# EAGLE design OVERWATCH Node (EAGLE 9.5.0)
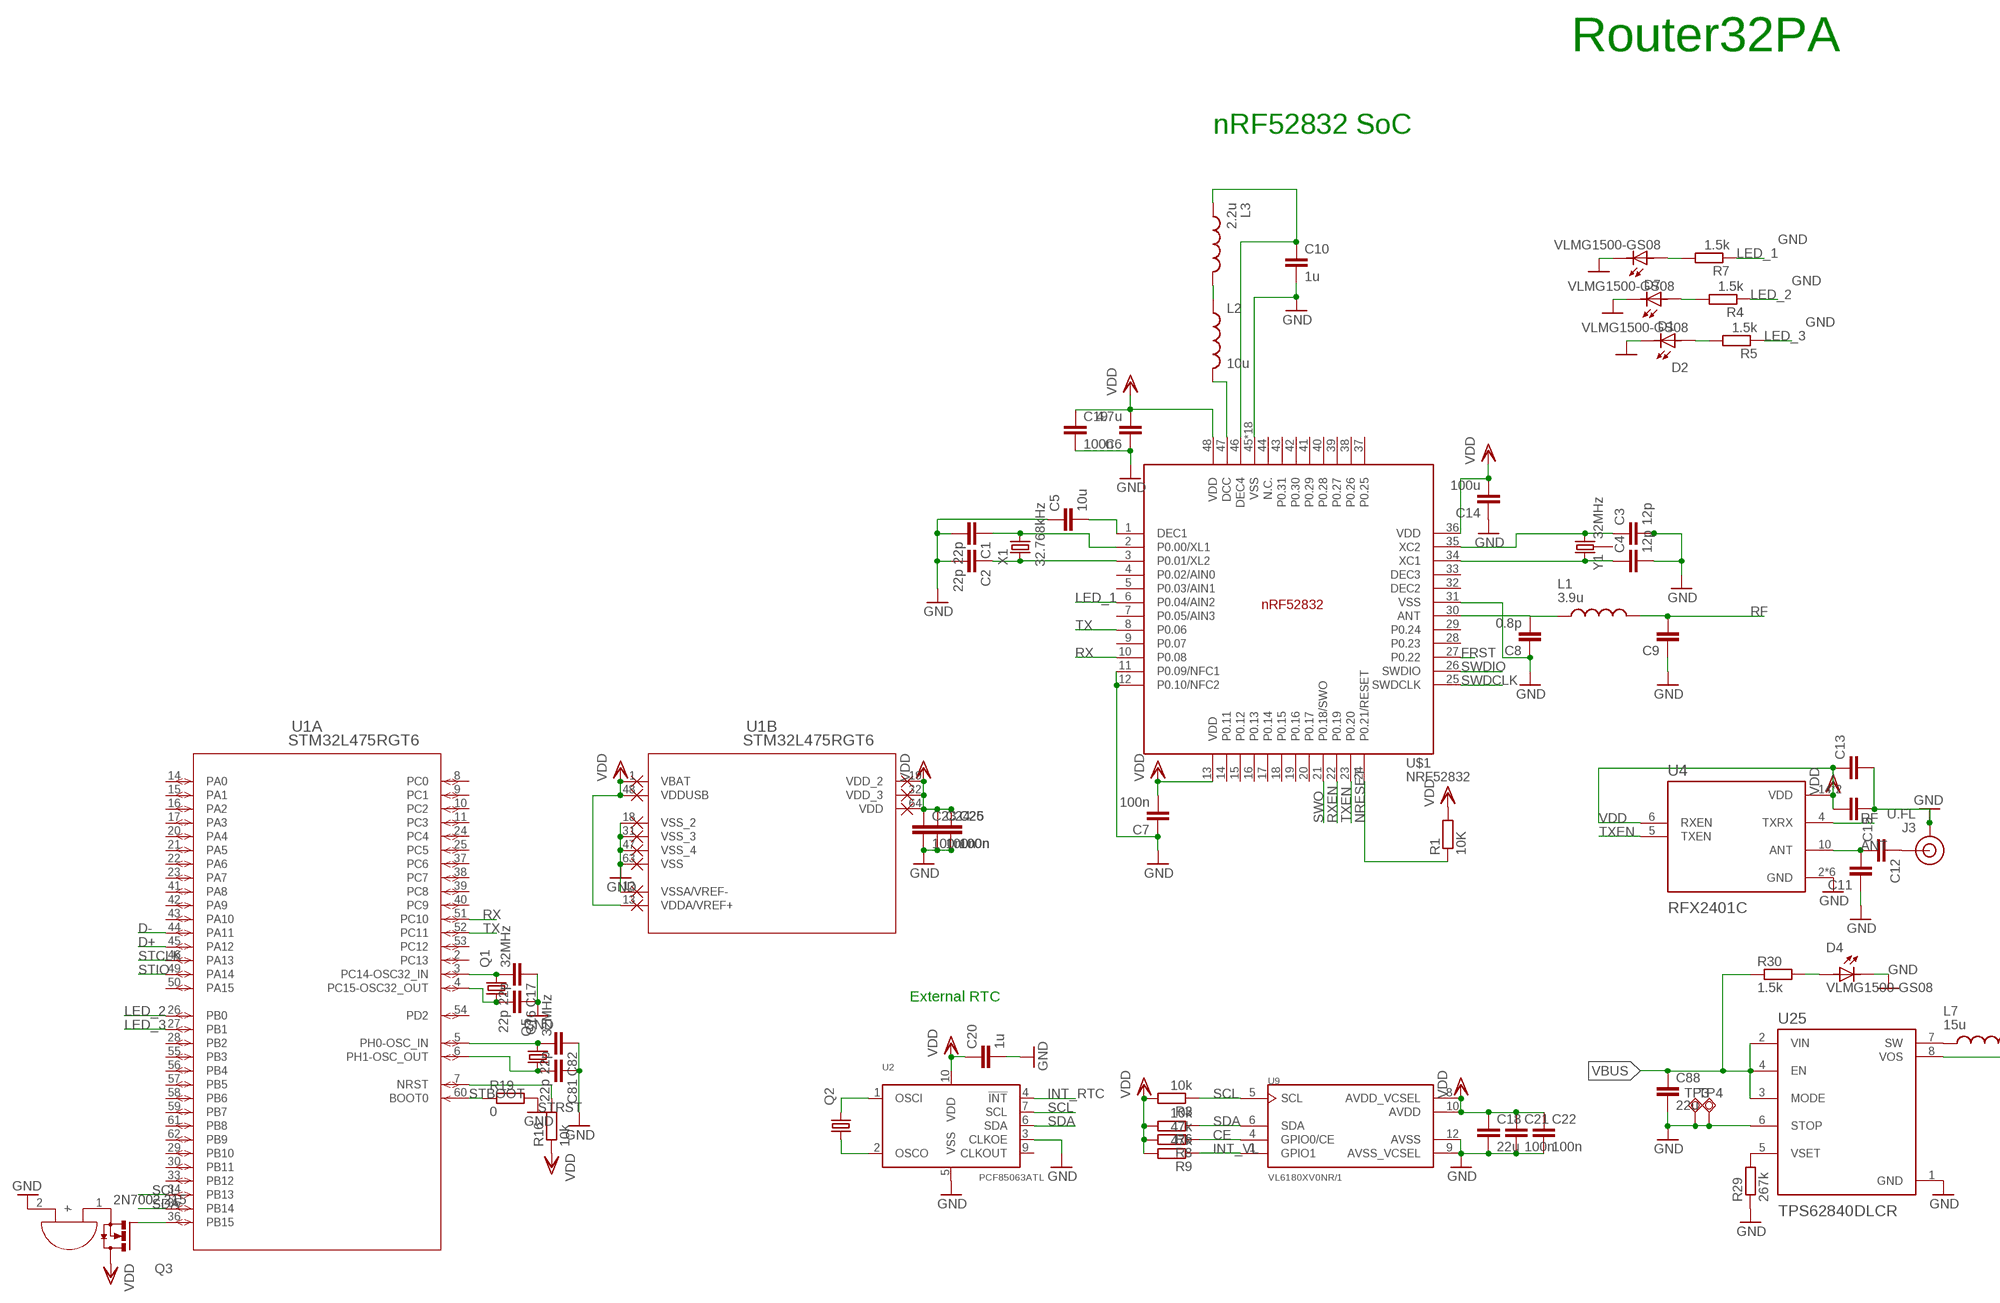
[diagram p0: schematic, sheet 1, part 1 of 2]
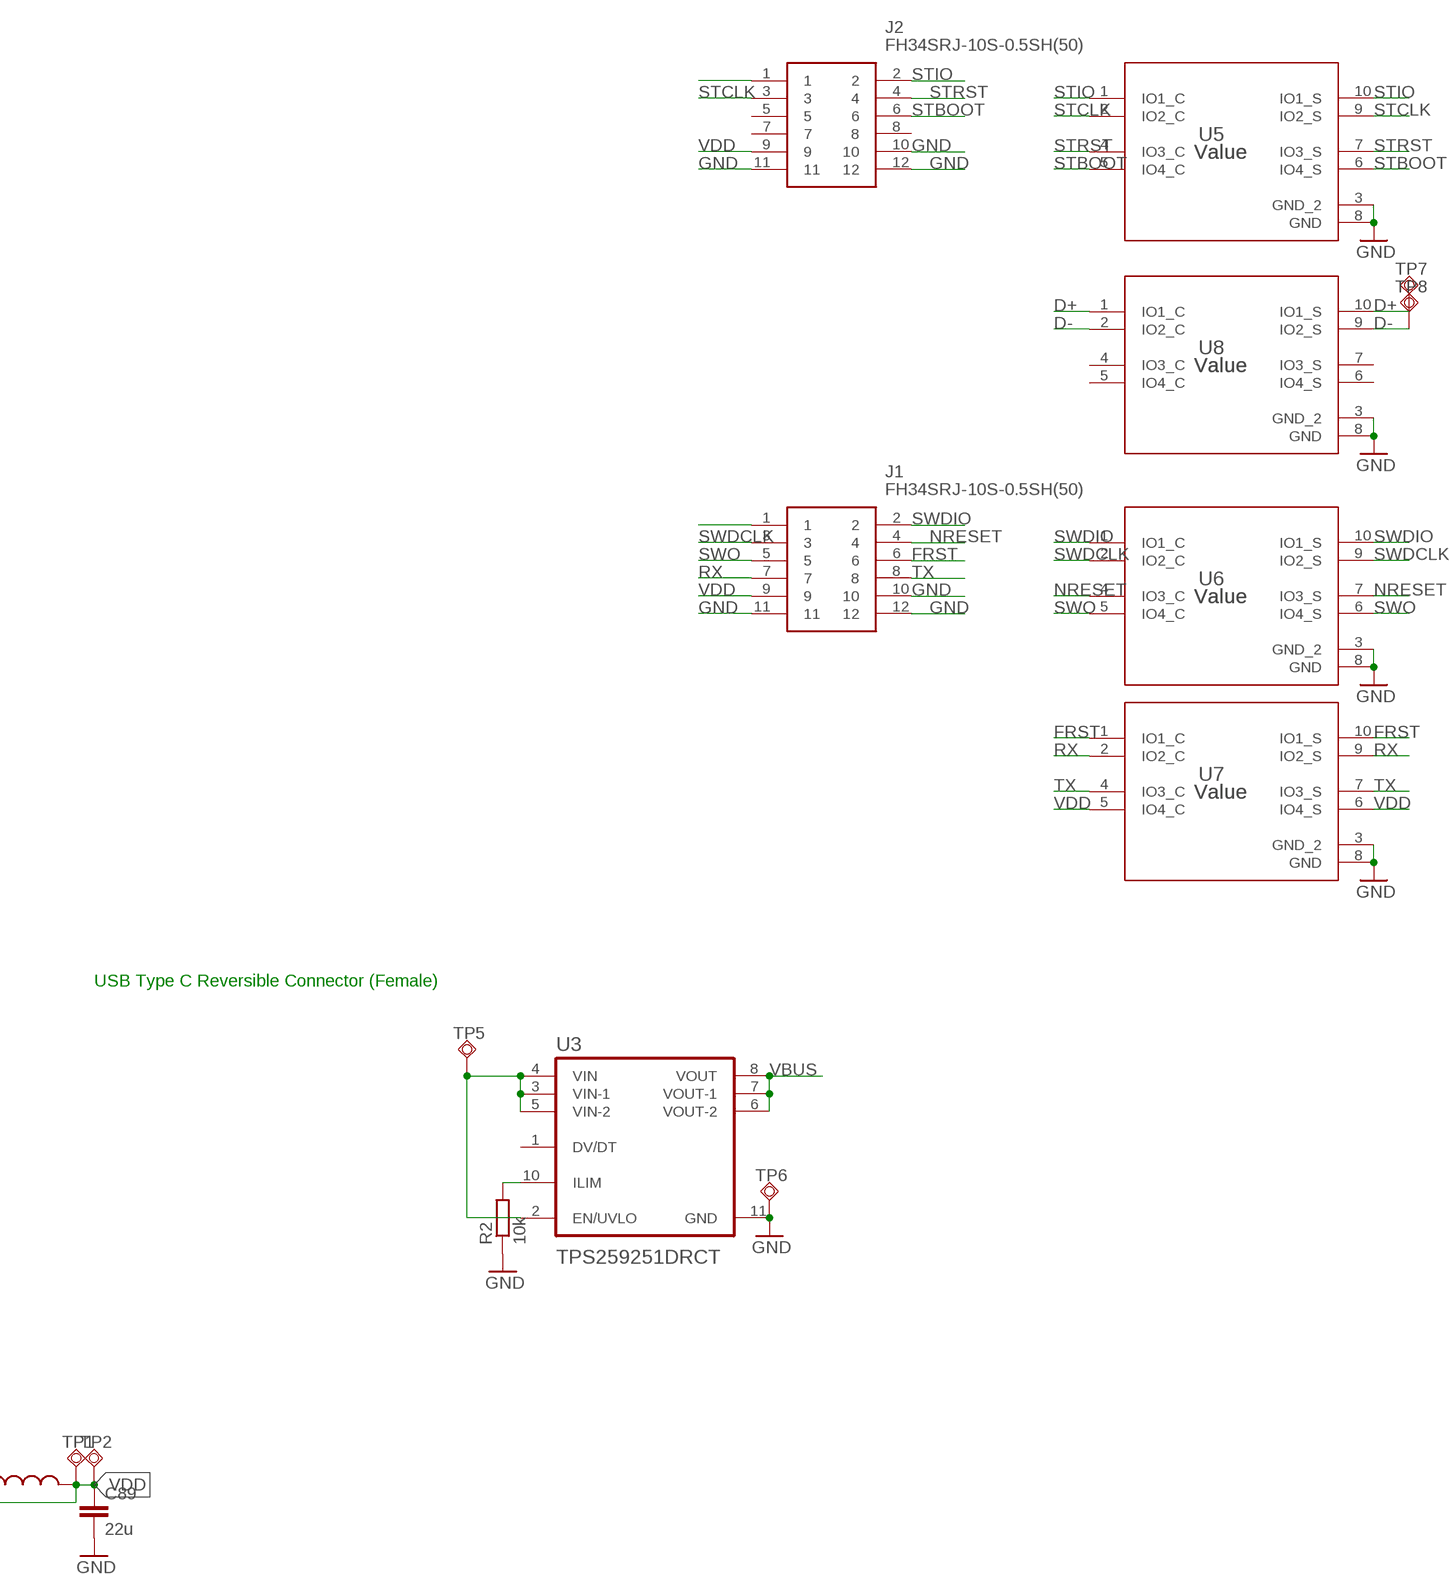
[diagram p1: schematic, sheet 1, part 2 of 2]

## Parts
C1  22p  CC0402  [C0402]
C2  22p  CC0402  [C0402]
C3  12p  CC0402  [C0402]
C4  12p  CC0402  [C0402]
C5  10u  CC0402  [C0402]
C6  4.7u  CC0402  [C0402]
C7  100n  CC0603R  [C0603R]
C8  0.8p  CC0402  [C0402]
C9  1.2p  CC0402  [C0402]
C10  1u  CC0402  [C0402]
C11  1.2p  CC0402  [C0402]
C12  1.2p  CC0402  [C0402]
C13  1.2p  CC0402  [C0402]
C14  100u  CC0402  [C0402]
C15  1.2p  CC0402  [C0402]
C16  22p  CC0402  [C0402]
C17  22p  CC0402  [C0402]
C18  22u  CC0603R  [C0603R]
C19  100n  CC0402  [C0402]
C20  1u  CC0603R  [C0603R]
C21  100n  CC0402  [C0402]
C22  100n  CC0402  [C0402]
C23  100n  CC0402  [C0402]
C24  100n  CC0402  [C0402]
C25  100n  CC0402  [C0402]
C26  100n  CC0402  [C0402]
C81  22p  CC0402  [C0402]
C82  22p  CC0402  [C0402]
C88  22u  CC0603R  [C0603R]
C89  22u  CC0603R  [C0603R]
D1  VLMG1500-GS08  [LEDC1005X35N]
D2  VLMG1500-GS08  [LEDC1005X35N]
D4  VLMG1500-GS08  [LEDC1005X35N]
D7  VLMG1500-GS08  [LEDC1005X35N]
J1  FH34SRJ-10S-0.5SH(50)  [FH34SRJ10S05SH50]
J2  FH34SRJ-10S-0.5SH(50)  [FH34SRJ10S05SH50]
J3  U.FL  U.FL2PIN  [U.FL]
L1  3.9u  MHQ0402P7N5JT000  [INDC0402X26N]
L2  10u  INDUCTOR  [L0603]
L3  2.2u  MHQ0402P7N5JT000  [INDC0402X26N]
L7  15u  1277AS-H-1R5M=P2  [INDC3225X120N]
Q1  32MHz  KX-5  [2.0X1.6_KX-5]
Q2  KX-327-RT  [2.0X1.2]
Q3  2N7002,215  [SOT23-3]
Q5  32MHz  KX-5  [2.0X1.6_KX-5]
R1  10K  RR0402  [R0402]
R2  10k  RR0402  [R0402]
R3  10k  RR0402  [R0402]
R4  1.5k  RR0402  [R0402]
R5  1.5k  RR0402  [R0402]
R6  10k  RR0402  [R0402]
R7  1.5k  RR0402  [R0402]
R8  47k  RR0402  [R0402]
R9  47k  RR0402  [R0402]
R16  10k  RR0402  [R0402]
R19  0  RR0402  [R0402]
R29  267k  RR0402  [R0402]
R30  1.5k  RR0402  [R0402]
TP1  TESTPAD_TPSQTP20SQ  [TESTPAD_TP20SQ]
TP2  TESTPAD_TPSQTP20SQ  [TESTPAD_TP20SQ]
TP3  TESTPAD_TPSQTP20SQ  [TESTPAD_TP20SQ]
TP4  TESTPAD_TPSQTP20SQ  [TESTPAD_TP20SQ]
TP5  TESTPAD_TPSQTP20SQ  [TESTPAD_TP20SQ]
TP6  TESTPAD_TPSQTP20SQ  [TESTPAD_TP20SQ]
TP7  TESTPAD_TPSQTP20SQ  [TESTPAD_TP20SQ]
TP8  TESTPAD_TPSQTP20SQ  [TESTPAD_TP20SQ]
U1  STM32L475RGT6  [LQFP64-10X10MM]
U2  PCF85063ATL  [SOT1197-1]
U3  TPS259251DRCT  [VREG_V62/16624-01YE]
U4  RFX2401C  [QFN50P300X300X60-17N]
U5  Value  ESD224DQAR  [DQA0010A]
U6  Value  ESD224DQAR  [DQA0010A]
U7  Value  ESD224DQAR  [DQA0010A]
U8  Value  ESD224DQAR  [DQA0010A]
U9  VL6180XV0NR/1  [LGA12R75P2X6_280X480X110]
U25  TPS62840DLCR  [SON50P200X150X100-8N]
U$1  NRF52832  [QFN40P600X600X90-48_N]
U$2  SMD_BUZZER  [SMD_BUZZER]
X1  32.768kHz  ABS07-32.768KHZ-T  [ABS07-32.768KHZ-T]
Y1  32MHz  CRYSTAL-26MHZSMD-3.2X2.5  [CRYSTAL-SMD-3.2X2.5MM]

## Nets
ANT: C11.2 C12.2 U4.10(ANT)
CE: R8.1 U9.4(GPIO0/CE)
D+: TP7.TP U1.45(A:PA12) U8.1(IO1_C) U8.10(IO1_S)
D-: TP8.TP U1.44(A:PA11) U8.2(IO2_C) U8.9(IO2_S)
FRST: J1.6 U7.1(IO1_C) U7.10(IO1_S) U$1.27(P0.22)
GND: C1.2 C2.2 C3.2 C4.2 C5.1 C6.1 C7.1 C8.1 C9.1 C10.2 C11.1 C13.2 C14.1 C15.1 C16.1 C17.1 C18.2 C19.2 C20.2 C21.2 C22.2 C23.2 C24.2 C25.2 C26.2 C81.1 C82.1 C88.2 C89.2 D1.2 D2.2 D4.2 D7.2 J1.10 J1.11 J1.12 J2.10 J2.11 J2.12 J3.1(GND) J3.2(GND) R2.1 R19.2 R29.1 TP3.TP TP4.TP TP6.TP U1.12(B:VSSA/VREF-) U1.18(B:VSS_2) U1.31(B:VSS_3) U1.47(B:VSS_4) U1.63(B:VSS) U2.3(CLKOE) U2.5(VSS) U3.11(GND) U4.2(GND) U4.3(GND) U4.8(GND) U4.9(GND) U4.11(GND) U4.17(GND) U5.3(GND_2) U5.8(GND) U6.3(GND_2) U6.8(GND) U7.3(GND_2) U7.8(GND) U8.3(GND_2) U8.8(GND) U9.9(AVSS_VCSEL) U9.12(AVSS) U25.1(GND) U25.6(STOP) U$1.11(P0.09/NFC1) U$1.12(P0.10/NFC2) U$1.31(VSS) U$1.45(VSS) U$1.PAD(VSS) U$1.PAD@VIA01(VSS) U$1.PAD@VIA02(VSS) U$1.PAD@VIA03(VSS) U$1.PAD@VIA04(VSS) U$1.PAD@VIA05(VSS) U$1.PAD@VIA06(VSS) U$1.PAD@VIA07(VSS) U$1.PAD@VIA08(VSS) U$1.PAD@VIA09(VSS) U$1.PAD@VIA10(VSS) U$1.PAD@VIA11(VSS) U$1.PAD@VIA12(VSS) U$1.PAD@VIA13(VSS) U$1.PAD@VIA14(VSS) U$1.PAD@VIA15(VSS) U$1.PAD@VIA16(VSS) U$2.2(-)
INT_RTC: U2.4(!INT!)
INT_VL: R9.1 U9.1(GPIO1)
LED_1: R7.1 U$1.6(P0.04/AIN2)
LED_2: R4.1 U1.26(A:PB0)
LED_3: R5.1 U1.27(A:PB1)
N$1: C1.1 U$1.2(P0.00/XL1) X1.2
N$2: C2.1 U$1.3(P0.01/XL2) X1.1
N$3: C3.1 U$1.35(XC2) Y1.3
N$4: C4.1 U$1.34(XC1) Y1.1
N$5: C5.2 U$1.1(DEC1)
N$6: C8.2 L1.1 U$1.30(ANT)
N$7: D1.1 R4.2
N$8: D2.1 R5.2
N$9: L2.2 U$1.47(DCC)
N$10: L2.1 L3.2
N$11: C10.1 L3.1 U$1.46(DEC4)
N$13: Q3.2(S) U$2.1(+)
N$14: C16.2 Q1.1 U1.4(A:PC15-OSC32_OUT)
N$15: C12.1 J3.FEED(SIGNAL)
N$16: C17.2 Q1.3 U1.3(A:PC14-OSC32_IN)
N$17: Q2.2 U2.1(OSCI)
N$18: Q2.1 U2.2(OSCO)
N$19: D7.1 R7.2
N$20: R2.2 U3.10(ILIM)
N$21: J2.1
N$22: TP5.TP U3.2(EN/UVLO) U3.3(VIN-1) U3.4(VIN) U3.5(VIN-2)
N$23: J1.1
N$24: Q3.1(G) U1.36(A:PB15)
N$62: C81.2 Q5.1 U1.6(A:PH1-OSC_OUT)
N$63: C82.2 Q5.3 U1.5(A:PH0-OSC_IN)
N$80: L7.1 U25.7(SW)
N$81: R29.2 U25.5(VSET)
N$84: D4.1 R30.2
NRESET: J1.4 R1.1 U6.4(IO3_C) U6.7(IO3_S) U$1.24(P0.21/RESET)
RF: C9.2 L1.2 U4.4(TXRX)
RX: J1.7 U1.51(A:PC10) U7.2(IO2_C) U7.9(IO2_S) U$1.10(P0.08)
RXEN: U$1.22(P0.19)
SCL: R3.1 U1.34(A:PB13) U2.7(SCL) U9.5(SCL)
SDA: R6.1 U1.35(A:PB14) U2.6(SDA) U9.6(SDA)
STBOOT: J2.6 R19.1 U1.60(A:BOOT0) U5.5(IO4_C) U5.6(IO4_S)
STCLK: J2.3 U1.46(A:PA13) U5.2(IO2_C) U5.9(IO2_S)
STIO: J2.2 U1.49(A:PA14) U5.1(IO1_C) U5.10(IO1_S)
STRST: J2.4 R16.2 U1.7(A:NRST) U5.4(IO3_C) U5.7(IO3_S)
SWDCLK: J1.3 U6.2(IO2_C) U6.9(IO2_S) U$1.25(SWDCLK)
SWDIO: J1.2 U6.1(IO1_C) U6.10(IO1_S) U$1.26(SWDIO)
SWO: J1.5 U6.5(IO4_C) U6.6(IO4_S) U$1.21(P0.18/SWO)
TX: J1.8 U1.52(A:PC11) U7.4(IO3_C) U7.7(IO3_S) U$1.8(P0.06)
TXEN: U4.5(TXEN) U$1.23(P0.20)
VBUS: C88.1 R30.1 U3.6(VOUT-2) U3.7(VOUT-1) U3.8(VOUT) U25.2(VIN) U25.3(MODE) U25.4(EN)
VDD: C6.2 C7.2 C13.1 C14.2 C15.2 C18.1 C19.1 C20.1 C21.1 C22.1 C23.1 C24.1 C25.1 C26.1 C89.1 J1.9 J2.9 L7.2 Q3.3(D) R1.2 R3.2 R6.2 R8.2 R9.2 R16.1 TP1.TP TP2.TP U1.1(B:VBAT) U1.13(B:VDDA/VREF+) U1.19(B:VDD_2) U1.32(B:VDD_3) U1.48(B:VDDUSB) U1.64(B:VDD) U2.10(VDD) U4.6(RXEN) U4.14(VDD) U4.16(VDD) U7.5(IO4_C) U7.6(IO4_S) U9.8(AVDD_VCSEL) U9.10(AVDD) U25.8(VOS) U$1.13(VDD) U$1.36(VDD) U$1.48(VDD)
Unconnected: J2.5 J2.7 J2.8 U1.2(A:PC13) U1.8(A:PC0) U1.9(A:PC1) U1.10(A:PC2) U1.11(A:PC3) U1.14(A:PA0) U1.15(A:PA1) U1.16(A:PA2) U1.17(A:PA3) U1.20(A:PA4) U1.21(A:PA5) U1.22(A:PA6) U1.23(A:PA7) U1.24(A:PC4) U1.25(A:PC5) U1.28(A:PB2) U1.29(A:PB10) U1.30(A:PB11) U1.33(A:PB12) U1.37(A:PC6) U1.38(A:PC7) U1.39(A:PC8) U1.40(A:PC9) U1.41(A:PA8) U1.42(A:PA9) U1.43(A:PA10) U1.50(A:PA15) U1.53(A:PC12) U1.54(A:PD2) U1.55(A:PB3) U1.56(A:PB4) U1.57(A:PB5) U1.58(A:PB6) U1.59(A:PB7) U1.61(A:PB8) U1.62(A:PB9) U2.9(CLKOUT) U3.1(DV/DT) U8.4(IO3_C) U8.5(IO4_C) U8.6(IO4_S) U8.7(IO3_S) U$1.4(P0.02/AIN0) U$1.5(P0.03/AIN1) U$1.7(P0.05/AIN3) U$1.9(P0.07) U$1.14(P0.11) U$1.15(P0.12) U$1.16(P0.13) U$1.17(P0.14) U$1.18(P0.15) U$1.19(P0.16) U$1.20(P0.17) U$1.28(P0.23) U$1.29(P0.24) U$1.32(DEC2) U$1.33(DEC3) U$1.37(P0.25) U$1.38(P0.26) U$1.39(P0.27) U$1.40(P0.28) U$1.41(P0.29) U$1.42(P0.30) U$1.43(P0.31) U$1.44(N.C.) Y1.2 Y1.4

## Notes on the sheet
- Router32PA
- nRF52832 SoC
- USB Type C Reversible Connector (Female)
- External RTC

## Library data of the parts
C1-C6 C8-C17 C19 C21-C26 C81 C82 = eagle-ltspice:C: CAPACITOR, European symbol; SPICEMODEL: NONE; SPICEPREFIX: C
C7 C18 C20 C88 C89 = eagle-ltspice:C: CAPACITOR, European symbol
D1 D2 D4 D7 = VLMG1500-GS08:VLMG1500-GS08: 0402 GREEN 571nm 35MCD 65° Rectangle with Flat Top SMT LED; AVAILABILITY: Unavailable; DESCRIPTION: 0402 GREEN 571nm 35MCD 65° Rectangle with Flat Top SMT LED; MF: Vishay; MP: VLMG1500-GS08; PACKAGE: 0402 Vishay; PRICE: None
J1 J2 = FH34SRJ-10S-0.5SH_50_:FH34SRJ-10S-0.5SH(50): HIROSE(HRS) - FH34SRJ-10S-0.5SH(50) - CONNECTOR, FFC/FPC, RCPT, 10POS, 1ROW Source: Datasheet <https://www.hirose.com/product/en/products/FH34SRJ/FH34SRJ-10S-0.5SH(50)/> Check prices <https://pricing.snapeda.com/search/part/FH34SRJ-10S-0.5SH%2850%29/?ref=eda>; AVAILABILITY: Good; DESCRIPTION: FFC & FPC Connectors 10POS 0.50MM R/A CONN FFC FPC; MF: Hirose Connector; MP: FH34SRJ-10S-0.5SH(50); PACKAGE: None; PRICE: None; PURCHASE-URL: https://pricing.snapeda.com/search/part/FH34SRJ-10S-0.5SH(50)/?ref=eda
J3 = SparkFun-Connectors:U.FL2PIN: SMD Antenna Connector - U.FL 2mm height, 3.0mm x 3.0mm receptacle size. SparkFun Products: SparkFun WiFi Shield - ESP8266 <https://www.sparkfun.com/products/13287> SparkFun ESP8266 Thing <https://www.sparkfun.com/products/13231> SparkFun MiniGen - Pro Mini Signal Generator Shield <https://www.sparkfun.com/products/11420>; PROD_ID: CONN-09193; SF_ID: WRL-09144
L1 L3 = MHQ0402P7N5JT000:MHQ0402P7N5JT000: 221 NH 5% GOLD TERMINAL; AVAILABILITY: Unavailable; DESCRIPTION: FIXED IND 7.5NH 200MA 1.2 OHM; MF: TDK; MP: MHQ0402P7N5JT000; PACKAGE: 0402 TDK; PRICE: None
L2 = BeagleBone_Blue_R3:INDUCTOR: Inductors Basic Inductor/Choke - 0603 and 1206. Footprints are not proven and vary greatly between part numbers. SRN6045- 33uH, 20% 1.4A
L7 = 1277AS-H-1R5M_P2:1277AS-H-1R5M=P2: Ind Metal Alloy Shielded 1.5uH 20% 1MHz Powdered Iron 2.6A 1210 T/R Check prices <https://pricing.snapeda.com/parts/1277AS-H-1R5M%3DP2/Murata/view-part?ref=eda>; AVAILABILITY: Warning; DESCRIPTION: Inductor with Inductance: 1.5uH Tol. +/-20%, Package: 1210 (3225); MF: Murata; MP: 1277AS-H-1R5M=P2; PACKAGE: 1210 Murata; PRICE: None; PURCHASE-URL: https://pricing.snapeda.com/search/part/1277AS-H-1R5M=P2/?ref=eda
Q1 Q5 = crystal-geyer_V1_0:KX: Quartz Crystals (MHz) SMD: KX - Serie Model Size l/w/h [mm] Frequency Range Frequency Stability Temp. Range [°C] Load Capacitance AECQ 200 availabel Datasheet KX-4 KX-5 KX-6 KX-7 KX-9A KX-9B KX-12A KX-12B KX-13 KX-20 KX-K KX-KS 1.6/1.2/0.3 2.0/1.6/0.45 2.5/2.0/0.55 3.2/2.5/0.8 5.0/3.2/1.0 5.0/3.2/1.1 6.0/3.5/1.1 6.0/3.5/1.0 7.0/5.0 /1.3 11.6/5.5/1.6 12.3/4.5/4.2 12.3/4.5/3.2 24.0 ~ 80.0 MHz 16.0 ~ 80.0 MHz 12.0 ~ 80.0 MHz 8.0 ~ 60.0 MHz 7,68 ~ 300,0 MHz 8,0 ~ 50,0 MHz 8,0 ~ 150,0 MHz 8,0 ~ 50,0 MHz 6,0 ~ 160,0 MHz 3,579 ~ 25,0 MHz 3,579 ~ 70,0 MHz 3,579 ~ 70,0 MHz ±10 … ±50ppm ±10 … ±50ppm ±10 … ±50ppm ±10 … ±50ppm ±10 … ±50ppm ±10 … ±50ppm ±10 … ±50ppm ±10 … ±50ppm ±10 … ±50ppm ±50ppm ±10 … ±50ppm ±10 … ±50ppm (*) -40°C …+85°C (*) -40°C …+125°C (*) -40°C …+125°C (*) -40°C …+125°C (*) -40°C …+105°C (*) -40°C …+105°C (*) -40°C …+125°C (*) -40°C …+105°C (*) -40°C …+105°C (*) -40°C …+105°C (*) -40°C …+85°C (*) -40°C …+85°C 8, 8…16 8, 8…16 10, 8…16 12, 7…20 16, 10…20 16, 10…20 16, 10…20 16, 12…20 16, 12…20 16, 12…20 16, 12…30 16, 12…30 - yes yes yes - - - - - - - - KX-4.pdf <http://www.geyer-electronic.de/uploads/tx_userartikelfrequenz/GEYER-KX-4.pdf> KX-5.pdf <http://www.geyer-electronic.de/uploads/tx_userartikelfrequenz/GEYER-KX-5.pdf> KX-6.pdf <http://www.geyer-electronic.de/uploads/tx_userartikelfrequenz/GEYER-KX-6.pdf> KX-7.pdf <http://www.geyer-electronic.de/uploads/tx_userartikelfrequenz/GEYER-KX-7.pdf> KX-9A.pdf <http://www.geyer-electronic.de/uploads/tx_userartikelfrequenz/GEYER-KX-9A.pdf> KX-9B.pdf <http://www.geyer-electronic.de/uploads/tx_userartikelfrequenz/GEYER-KX-9B.pdf> KX-12A.pdf <http://www.geyer-electronic.de/uploads/tx_userartikelfrequenz/GEYER-KX-12A.pdf> KX-12B.pdf <http://www.geyer-electronic.de/uploads/tx_userartikelfrequenz/GEYER-KX-12B.pdf> KX-13.pdf <http://www.geyer-electronic.de/uploads/tx_userartikelfrequenz/GEYER-KX-13.pdf> KX-20.pdf <http://www.geyer-electronic.de/uploads/tx_userartikelfrequenz/GEYER-KX-20.pdf> KX-K.pdf <http://www.geyer-electronic.de/uploads/tx_userartikelfrequenz/GEYER-KX-K.pdf> KX-KS.pdf <http://www.geyer-electronic.de/uploads/tx_userartikelfrequenz/GEYER-KX-KS.pdf> <http://www.geyer-electronic.de/fileadmin/template/img/logo-geyer-electronic.png> Details see: http://www.geyer-electronic.de/Frequenz-Produkte.9.0.html Created 2016-06-07, Hans Locher 2016 (C) Geyer Quartz Technology KX4,KX5,KX6,KX7,KX9A,KX9B,KX12A,KX12B,KX13,KX20,KXK,KXKS;1612;2016;2520;3225;5032;6035;7050;11655;12345;1,6x1,2;2,0x1,6;2,5x2,0;3,2x2,5;5,0x3,2;6,0x3,5;7,0x5,0;11,6x5,5;12,3x4,5;12,3x4,5;1.6x1.2;2.0x1.6;2.5x2.0;3.2x2.5;5.0x3.2;6.0x3.5;7.0x5.0;11.6x5.5;12.3x4.5;12.3x4.5;
Q2 = crystal-geyer_V1_0:KX-327: Tuning Fork Crystals (kHz) SMD: KX327 - Serie Model Size l/w/h [mm] Frequency Range Frequency Stability Temp. Range [°C] Load Capacitance AECQ 200 availabel Datasheet KX-327VT KX-327FT KX-327RT KX-327NHT KX-327NHF KX-327L KX-327S 1.25/1.05/0.5 1.6/1.0/0.5 2.0/1.2/0.6 3.2/1.5/0.8 3.2/1.5/0.8 7.0/1.5/1.4 8.2/3.8/2.5 32,768 kHz 32,768 kHz 32,768 kHz 32,768 kHz 32,768 kHz 32,768 kHz 32,768 kHz ±10 … ±20ppm ±10 … ±20ppm ±10 … ±20ppm ±10 … ±20ppm ±10 … ±20ppm ±10 … ±20ppm ±5 … ±20ppm (*) -40°C …+85°C (*) -40°C …+85°C (*) -40°C …+85°C (*) -40°C …+85°C (*) -40°C …+125°C (*) -40°C …+85°C (*) -40°C …+85°C 7/9/12,5 7/9/12,5 7/9/12,6 7/9/12,5 9/12,5 7/9/12,5 6/12,5 - - - - yes - - KX-327VT.pdf <http://www.geyer-electronic.de/uploads/tx_userartikelfrequenz/GEYER-KX-327VT.pdf> KX-327FT.pdf <http://www.geyer-electronic.de/uploads/tx_userartikelfrequenz/GEYER-KX-327FT.pdf> KX-327RT.pdf <http://www.geyer-electronic.de/uploads/tx_userartikelfrequenz/GEYER-KX-327RT.pdf> KX-327NHT.pdf <http://www.geyer-electronic.de/uploads/tx_userartikelfrequenz/GEYER-KX-327NHT.pdf> KX-327NHF.pdf <http://www.geyer-electronic.de/uploads/tx_userartikelfrequenz/GEYER-KX-327NHF.pdf> KX-327L.pdf <http://www.geyer-electronic.de/uploads/tx_userartikelfrequenz/GEYER-KX-327L.pdf> KX-327S.pdf <http://www.geyer-electronic.de/uploads/tx_userartikelfrequenz/GEYER-KX-327S.pdf> <http://www.geyer-electronic.de/fileadmin/template/img/logo-geyer-electronic.png> Details see: http://www.geyer-electronic.de/Frequenz-Produkte.9.0.html Created 2016-06-07, Hans Locher 2016 (C) Geyer Quartz Technology KX327VT,KX327FT,KX327RT,KX327NHT,KX327NHF,KX327S,KX327L;125105;1610;2012;3215;7015;8238;1,25x1,05,1.25x1.05;1,6x1,0,1.6x1.0;2,0x1,2,2.0x1.2;3,2x1,5,3.2x1.5;8,2x3,8,8.2x3.8,7.0x1.5,7,0x1,532.768kHz
Q3 = Transistor:2N7002,215: MOSFET N-CH 60V 300MA SOT-23 Manufacturer's datasheet <https://assets.nexperia.com/documents/data-sheet/2N7002.pdf>; CREATED_BY: PCBLayout.com; DIGIKEY_PART_NUMBER: 1727-2764-1-ND; MANUFACTURER: Nexperia USA Inc.; MPN: 2N7002,215; PACKAGE: SOT-23-3
R1-R9 R16 R19 R29 R30 = eagle-ltspice:R: RESISTOR, European symbol; SPICEMODEL: NONE; SPICEPREFIX: R
TP1-TP8 = BeagleBone_Blue_R3:TESTPAD_TPSQ: Test pad
U1 = STM32L475RGT6:STM32L475RGT6; BUILT_BY: EMA_UL_Team; COPYRIGHT: Copyright (C) 2018 Accelerated Designs. All rights reserved; MANUFACTURER_PART_NUMBER: STM32L475RGT6; SOURCELIBRARY: Updates_to_database_2020-10-19; VENDOR: STMicroelectronics
U2 = PCF85063ATL:PCF85063ATL: Tiny Real-Time Clock/calendar with alarm function and I2C-bus The PCF85063A is a CMOS1 Real-Time Clock (RTC) and calendar optimized for low power consumption. An offset register allows fine-tuning of the clock. All addresses and data are transferred serially via the two-line bidirectional I2C-bus. Maximum data rate is 400 kbit/s. The register address is incremented automatically after each written or read data byte. AAL Eindhoven MK; AVAILABILITY: Unavailable; DESCRIPTION: Real Time Clock _RTC_ IC Clock/Calendar I²C, 2-Wire Serial 10-XFDFN Exposed Pad; MF: NXP USA; MP: PCF85063ATL; PACKAGE: DFN-10 NXP Semiconductors; PRICE: None
U3 = TPS259251DRCT:TPS259251DRCT: Check prices <https://pricing.snapeda.com/parts/TPS259251DRCT/Texas%20Instruments/view-part?ref=eda>; AVAILABILITY: Warning; DESCRIPTION: 4.5-V-5.5-V, 30m?, 2-5A eFuse 10-VSON -40 to 85; MF: Texas Instruments; MP: TPS259251DRCT; PACKAGE: VSON-10 Texas Instruments; PRICE: None; PURCHASE-URL: https://pricing.snapeda.com/search/part/TPS259251DRCT/?ref=eda
U4 = RFX2401C:RFX2401C: None Check prices <https://pricing.snapeda.com/parts/RFX2401C/Skyworks%20Solutions/view-part?ref=eda>; AVAILABILITY: Warning; DESCRIPTION: RF Front End 2.4GHz ~ 2.5GHz 802.15.4, Zigbee® 16-QFN (3x3); MF: Skyworks Solutions; MP: RFX2401C; PACKAGE: UFQFN-16 Skyworks Solutions; PRICE: None; PURCHASE-URL: https://pricing.snapeda.com/search/part/RFX2401C/?ref=eda
U5-U8 = ESD7004MUTAG:ESD224DQAR; MANUFACTURER: Texas Instruments; PARTNUMBER: ESD224DQAR; REFDES: RefDes; TYPE: TYPE
U9 = VL6180XV0NR_1:VL6180XV0NR/1: VL6180X Series 3 V Proximity and Ambient Light Sensing (ALS) Module - LGA-12 Check prices <https://pricing.snapeda.com/parts/VL6180XV0NR/1/STMicroelectronics/view-part?ref=eda>; AVAILABILITY: Good; DESCRIPTION: Optical Sensor I²C Output; MF: STMicroelectronics; MP: VL6180XV0NR/1; PACKAGE: SMD-12 STMicroelectronics; PRICE: None; PURCHASE-URL: https://pricing.snapeda.com/search/part/VL6180XV0NR/1/?ref=eda
U25 = TPS62840DLCR:TPS62840DLCR: None Check prices <https://snapeda.com/parts/TPS62840DLCR/Texas%20Instruments/view-part/?ref=eda> Check prices <https://pricing.snapeda.com/parts/TPS62840DLCR/Texas%20Instruments/view-part?ref=eda>; AVAILABILITY: Warning; DESCRIPTION: 60-nA IQ, 1.8-V to 6.5-VIN, high-efficiency 750-mA step-down converter 8-VSON-HR -40 to 125; MF: Texas Instruments; MP: TPS62840DLCR; PACKAGE: VSON-HR-8 Texas Instruments; PRICE: None; PURCHASE-URL: https://pricing.snapeda.com/search/part/TPS62840DLCR/?ref=eda
U$1 = Nordic_nRF:NRF52832: nRF52832 Features Single chip, highly flexible, 2.4 GHz multi-protocol SoC 32-bit ARM Cortex-M4F Processor 1.7v to 3.6v operation 512kB flash + 64kB RAM Supports concurrent Bluetooth Smart/ANT protocol operation On-chip NFC tag for Out-of-Band (OOB) pairing Up to +4dBm output power -96dBm sensitivity, Bluetooth Smart Thread safe and run-time protected Event driven API On air compatible with nRF24L and nRF24AP series 2 data rates (2Mbps/1Mbps) PPI - maximum flexibility for power-efficient applications and code simplification Automated power management system with automatic power management of each peripheral Configurable I/O mapping for analog and digital I/O 3 x Master/Slave SPI 2 x Two-wire interface (I²C) UART (RTS/CTS) 3 x PWM AES HW encryption Real Time Counter (RTC) Digital microphone interface (PDM) On-chip balun Applications Internet of Things (IoT) Wearables SmartHome sensors Connected white goods Computer peripherals Voice-command smart remotes A4WP ‘Rezence’ wireless charging Beacons Sports and fitness sensors and hubs Connected health products Smart watches RC Toys Interactive games Building automation and sensor networks
U$2 = SMD_BUZZER:SMD_BUZZER
X1 = Crystals:ABS07-32.768KHZ-T: CRYSTAL 32.7680KHZ 12.5PF SMD Manufacturer's datasheet <https://abracon.com/Resonators/ABS07.pdf>; CREATED_BY: PCBLayout.com; DIGIKEY_PART_NUMBER: 535-9542-2-ND; MANUFACTURER: Abracon LLC; MPN: ABS07-32.768KHZ-T; PACKAGE: SMD-2
Y1 = SparkFun-Clocks:CRYSTAL-26MHZ: 26MHz Crystal w/ Ground Pin Digikey Example <http://www.digikey.com/product-detail/en/epson/TSX-3225%2026.0000MF09Z-AC3/SER3627CT-ND/1802878> Frequency: 26MHz Frequency Stability: ±9ppm Frequency Tolerance: ±10ppm Load Capacitance: 9pF SparkFun Products: SparkFun ESP32 Thing <https://www.sparkfun.com/products/13907> SparkFun ESP8266 Thing Dev Board <https://www.sparkfun.com/products/13711>; PROD_ID: XTAL-12454

## Net classes
1 RF: clearance 0.4 mm

## Board
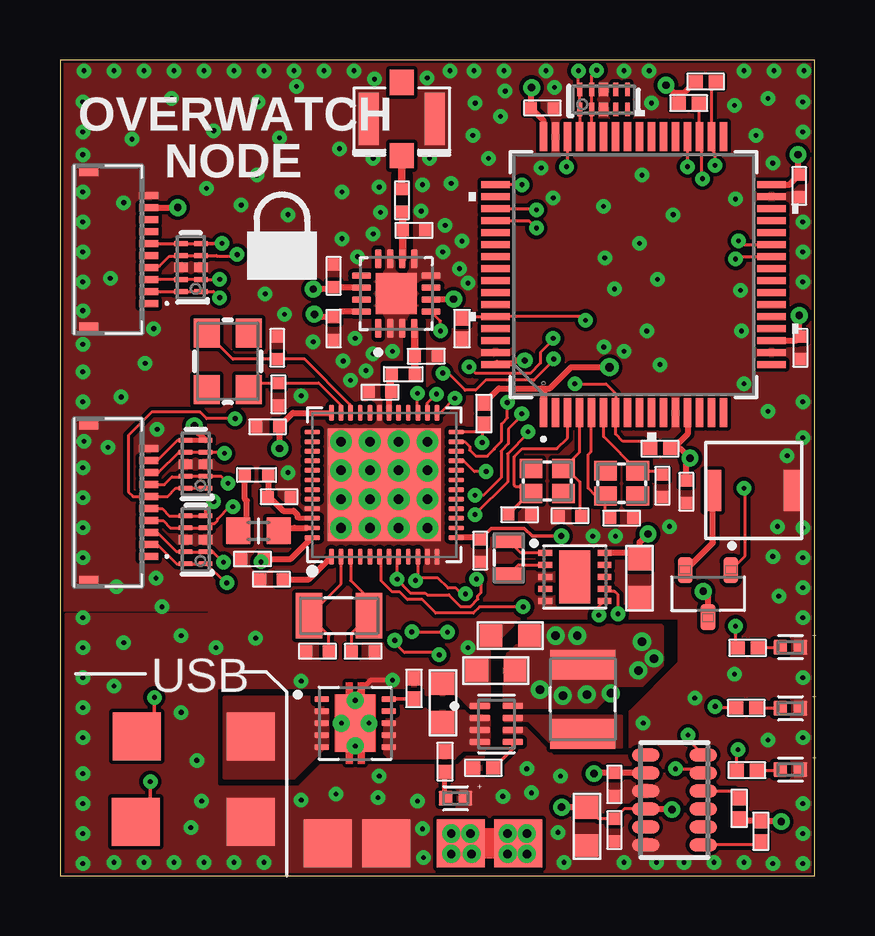
[diagram p2: board, top side]
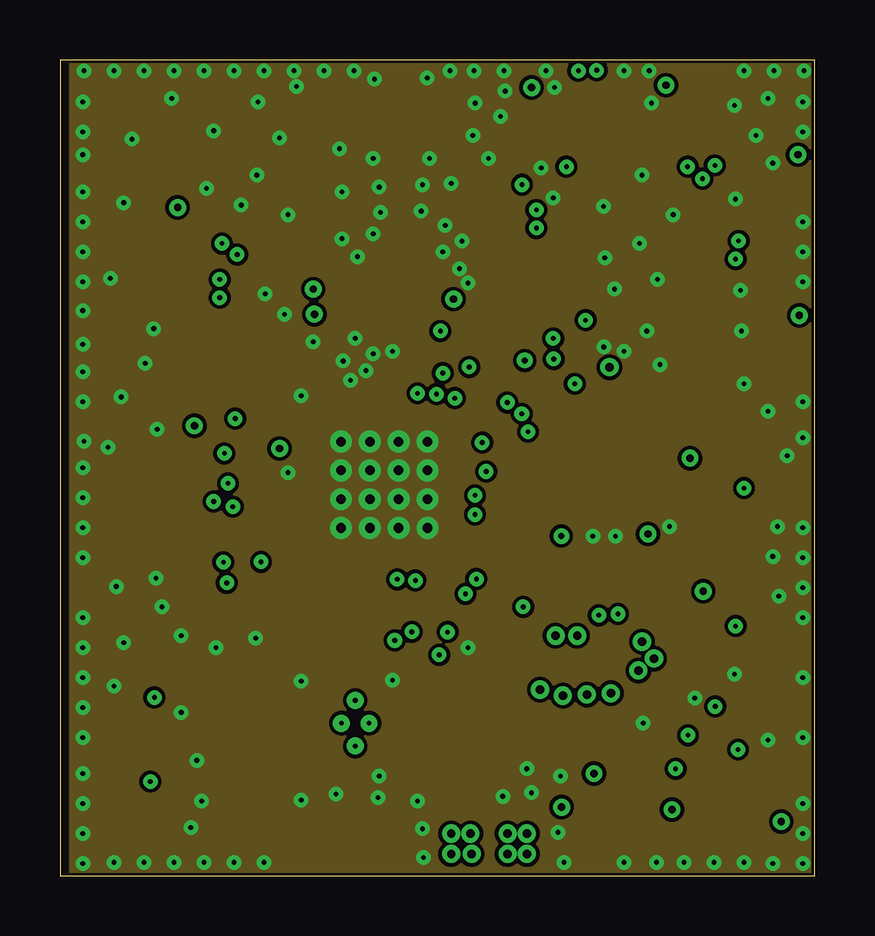
[diagram p3: board, inner layer GND]
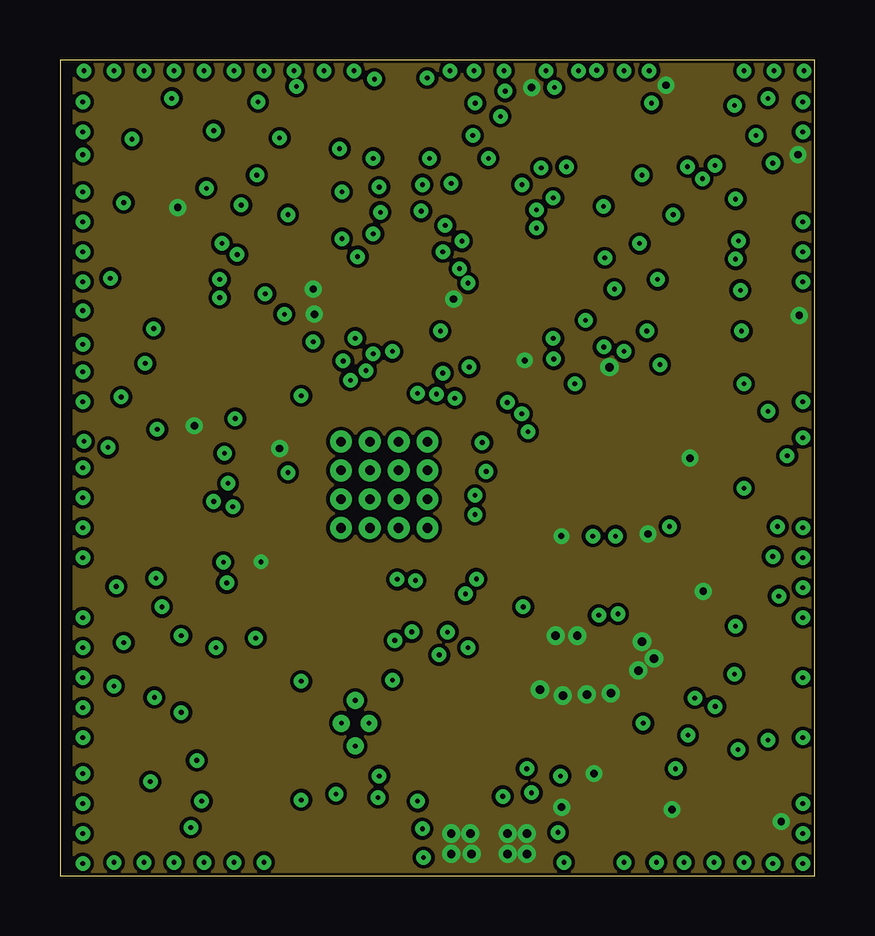
[diagram p4: board, inner layer VDD]
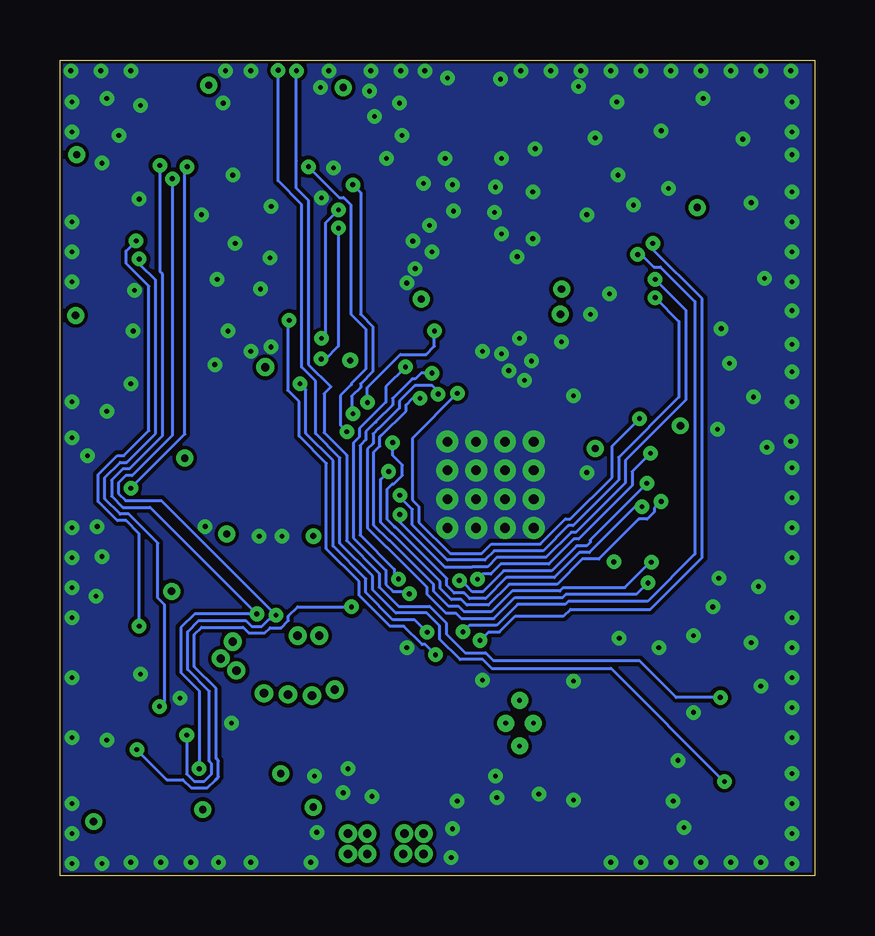
[diagram p5: board, bottom side, seen from below]

Size 31.45 x 34 mm. Coordinates in mm from the lower left corner, seen from the top.
Outline: 0,0 31.45,0 31.45,34 0,34 0,0
Copper layers (1+2*15+16): Top 0.035mm / dielectric 0.2mm / GND 0.035mm / dielectric 0.45mm / VDD 0.035mm / dielectric 0.2mm / Bottom 0.035mm
Design rules "default *": minimum track width 5mil, minimum drill 0.2mm, track to track 6mil, track to pad 6mil, pad to pad 6mil, via to via 6mil, smd to smd 6mil, copper to edge 5mil, drill to drill 6mil, minimum pad ring 10mil, minimum via ring 8mil, stop-mask expansion 0mil, vias tented up to drill 40mil, thermal gap 0mil
tRestrict: 9 lines

### Footprints (pad centres in the part's own frame; a part is rotated, then mirrored left to right if it is on the bottom)
C0402 = smd 0.5 x 0.5: 1 -0.475,0; 2 0.475,0
C0603R = smd 0.95 x 0.95: 1 -0.85,0; 2 0.75,0
LEDC1005X35N = smd 0.59 x 0.61: 1 -0.415,0; 2 0.415,0
FH34SRJ10S05SH50 = smd 0.3 x 0.8: 1 2.25,1.55; 2 1.75,1.55; 3 1.25,1.55; 4 0.75,1.55; 5 0.25,1.55; 6 -0.25,1.55; 7 -0.75,1.55; 8 -1.25,1.55; 9 -1.75,1.55; 10 -2.25,1.55 | smd 0.4 x 0.8: 11 -3.25,-0.95; 12 3.25,-0.95
U.FL = smd 2.2 x 0.85: 1 0,1.375; 2 0,-1.375 | smd 1.05 x 1: FEED 1.525,0; NC -1.525,0
INDC0402X26N = smd 0.5 x 0.5: 1 -0.732,0; 2 0.232,0
L0603 = smd 1 x 1.1: 1 -0.85,0; 2 0.85,0
INDC3225X120N = smd 1.24 x 2.72: 1 -1.44,0; 2 1.44,0
2.0X1.6_KX-5 = smd 0.95 x 0.8: 1 -0.675,-0.525; 2 0.675,-0.525; 3 0.675,0.525; 4 -0.675,0.525
2.0X1.2 = smd 0.6 x 1.1: 1 -0.7,0; 2 0.7,0
SOT23-3 = smd 0.62 x 1.1: 1 -0.95,-0.975; 2 0.95,-0.975; 3 0,0.975
R0402 = smd 0.6 x 0.55: 1 -0.425,0; 2 0.425,0
TESTPAD_TP20SQ = smd 2 x 2: TP 0,0
LQFP64-10X10MM = smd 1.194 x 0.305: 1 -5.75,3.75; 2 -5.75,3.25; 3 -5.75,2.75; 4 -5.75,2.25; 5 -5.75,1.75; 6 -5.75,1.25; 7 -5.75,0.75; 8 -5.75,0.25; 9 -5.75,-0.25; 10 -5.75,-0.75; 11 -5.75,-1.25; 12 -5.75,-1.75; 13 -5.75,-2.25; 14 -5.75,-2.75; 15 -5.75,-3.25; 16 -5.75,-3.75; 33 5.75,-3.75; 34 5.75,-3.25; 35 5.75,-2.75; 36 5.75,-2.25; 37 5.75,-1.75; 38 5.75,-1.25; 39 5.75,-0.75; 40 5.75,-0.25; 41 5.75,0.25; 42 5.75,0.75; 43 5.75,1.25; 44 5.75,1.75; 45 5.75,2.25; 46 5.75,2.75; 47 5.75,3.25; 48 5.75,3.75 | smd 0.305 x 1.194: 17 -3.75,-5.75; 18 -3.25,-5.75; 19 -2.75,-5.75; 20 -2.25,-5.75; 21 -1.75,-5.75; 22 -1.25,-5.75; 23 -0.75,-5.75; 24 -0.25,-5.75; 25 0.25,-5.75; 26 0.75,-5.75; 27 1.25,-5.75; 28 1.75,-5.75; 29 2.25,-5.75; 30 2.75,-5.75; 31 3.25,-5.75; 32 3.75,-5.75; 49 3.75,5.75; 50 3.25,5.75; 51 2.75,5.75; 52 2.25,5.75; 53 1.75,5.75; 54 1.25,5.75; 55 0.75,5.75; 56 0.25,5.75; 57 -0.25,5.75; 58 -0.75,5.75; 59 -1.25,5.75; 60 -1.75,5.75; 61 -2.25,5.75; 62 -2.75,5.75; 63 -3.25,5.75; 64 -3.75,5.75
SOT1197-1 = smd 0.25 x 0.575: 1 -1,-1.238; 2 -0.5,-1.238; 3 0,-1.238; 4 0.5,-1.238; 5 1,-1.238; 6 1,1.238; 7 0.5,1.238; 8 0,1.238; 9 -0.5,1.238; 10 -1,1.238 | smd 2.2 x 1.3: CP 0,0
VREG_V62/16624-01YE = smd 0.6 x 0.24: 1 -1.4,1; 2 -1.4,0.5; 3 -1.4,0; 4 -1.4,-0.5; 5 -1.4,-1; 6 1.4,-1; 7 1.4,-0.5; 8 1.4,0; 9 1.4,0.5; 10 1.4,1 | smd 1.65 x 2.4: 11 0,0 | drill 0.2 pad 0.3: 12 0,-0.95; 13 -0.575,0; 14 0.575,0; 15 0,0.95
QFN50P300X300X60-17N = smd 0.81 x 0.27: 1 -1.445,0.75; 2 -1.445,0.25; 3 -1.445,-0.25; 4 -1.445,-0.75; 9 1.445,-0.75; 10 1.445,-0.25; 11 1.445,0.25; 12 1.445,0.75 | smd 0.27 x 0.81: 5 -0.75,-1.445; 6 -0.25,-1.445; 7 0.25,-1.445; 8 0.75,-1.445; 13 0.75,1.445; 14 0.25,1.445; 15 -0.25,1.445; 16 -0.75,1.445 | smd 1.7 x 1.7: 17 0,0
DQA0010A = smd 0.565 x 0.2: 1 -0.417,1; 2 -0.417,0.5; 4 -0.417,-0.5; 5 -0.417,-1; 6 0.417,-1; 7 0.417,-0.5; 9 0.417,0.5; 10 0.417,1 | smd 0.565 x 0.4: 3 -0.417,0; 8 0.417,0
LGA12R75P2X6_280X480X110 = smd 1.15 x 0.55: 1 -1.2,1.875; 2 -1.2,1.125; 3 -1.2,0.375; 4 -1.2,-0.375; 5 -1.2,-1.125; 6 -1.2,-1.875; 7 1.2,-1.875; 8 1.2,-1.125; 9 1.2,-0.375; 10 1.2,0.375; 11 1.2,1.125; 12 1.2,1.875
SON50P200X150X100-8N = smd 0.86 x 0.27: 1 -0.685,0.75; 2 -0.685,0.25; 3 -0.685,-0.25; 4 -0.685,-0.75; 5 0.685,-0.75; 6 0.685,-0.25; 7 0.685,0.25; 8 0.685,0.75
QFN40P600X600X90-48_N = smd 0.65 x 0.2: 1 -3,2.2; 2 -3,1.8; 3 -3,1.4; 4 -3,1; 5 -3,0.6; 6 -3,0.2; 7 -3,-0.2; 8 -3,-0.6; 9 -3,-1; 10 -3,-1.4; 11 -3,-1.8; 12 -3,-2.2; 25 3,-2.2; 26 3,-1.8; 27 3,-1.4; 28 3,-1; 29 3,-0.6; 30 3,-0.2; 31 3,0.2; 32 3,0.6; 33 3,1; 34 3,1.4; 35 3,1.8; 36 3,2.2 | smd 0.2 x 0.65: 13 -2.2,-3; 14 -1.8,-3; 15 -1.4,-3; 16 -1,-3; 17 -0.6,-3; 18 -0.2,-3; 19 0.2,-3; 20 0.6,-3; 21 1,-3; 22 1.4,-3; 23 1.8,-3; 24 2.2,-3; 37 2.2,3; 38 1.8,3; 39 1.4,3; 40 1,3; 41 0.6,3; 42 0.2,3; 43 -0.2,3; 44 -0.6,3; 45 -1,3; 46 -1.4,3; 47 -1.8,3; 48 -2.2,3 | smd 4.7 x 4.7: PAD 0,0 | drill 0.4: PAD@VIA01 -1.8,1.8; PAD@VIA02 -1.8,0.6; PAD@VIA03 -1.8,-0.6; PAD@VIA04 -1.8,-1.8; PAD@VIA05 -0.6,1.8; PAD@VIA06 -0.6,0.6; PAD@VIA07 -0.6,-0.6; PAD@VIA08 -0.6,-1.8; PAD@VIA09 0.6,1.8; PAD@VIA10 0.6,0.6; PAD@VIA11 0.6,-0.6; PAD@VIA12 0.6,-1.8; PAD@VIA13 1.8,1.8; PAD@VIA14 1.8,0.6; PAD@VIA15 1.8,-0.6; PAD@VIA16 1.8,-1.8
SMD_BUZZER = smd 0.7 x 1.7: 1 0,0; 2 3.3,0
ABS07-32.768KHZ-T = smd 1.1 x 1.9: 1 -1.25,0; 2 1.25,0
CRYSTAL-SMD-3.2X2.5MM = smd 1.2 x 1.1: 1 -1.175,-0.875; 2 1.175,-0.875; 3 1.175,0.875; 4 -1.175,0.875

### Placement (x,y rotation side)
C1  10.73,9.35 180 top
C2  12.63,9.35 0 top
C3  9.1,20.06 270 top
C4  9.05,22 90 top
C5  8.81,12.35 0 top
C6  8.02,13.2 0 top
C7  18.21,8.55 0 top
C8  13.33,20.15 0 top
C9  15.26,21.65 180 top
C10  9.13,15.79 0 top
C11  14.75,26.9 180 top
C12  14.25,28.15 270 top
C13  11.4,22.8 270 top
C14  17.51,13.54 90 top
C15  11.4,25 270 top
C16  21.25,15 0 top
C17  19.15,15.05 180 top
C18  21.95,2 270 top
C19  8.65,18.71 180 top
C20  24.15,12.35 270 top
C21  23.1,1.9 270 top
C22  23.1,3.8 270 top
C23  26.1,16 270 top
C24  20.1,32 0 top
C25  30.85,22 270 top
C26  30.8,28.75 270 top
C81  25.1,16.25 90 top
C82  23.4,14.9 180 top
C88  15.95,7.25 90 top
C89  18.71,10 180 top
D1  30.43,6.97 0 top
D2  30.43,9.52 0 top
D4  16.48,3.22 0 top
D7  30.43,4.42 0 top
J1  2.15,15.55 270 top
J2  2.15,26.1 270 top
J3  14.24,31.54 270 top
L1  14.55,20.9 0 top
L2  8.27,14.37 0 top
L3  7.94,16.7 180 top
L7  21.78,7.35 90 top
Q1  20.3,16.45 180 top
Q2  18.7,13.25 90 top
Q3  27,11.75 180 top
Q5  23.4,16.35 180 top
R1  17.66,19.26 90 top
R2  14.75,7.8 270 top
R3  26.9,33.1 180 top
R4  28.59,6.99 0 top
R5  28.65,9.49 0 top
R6  26.2,32.2 180 top
R7  28.62,4.39 0 top
R8  28.3,2.8 270 top
R9  29.2,1.85 90 top
R16  25,17.8 180 top
R19  16.75,22.8 270 top
R29  17.64,4.49 0 top
R30  16.04,4.75 270 top
TP1  19.1,1.35 180 top
TP2  16.7,1.35 180 top
TP3  13.6,1.35 180 top
TP4  11.15,1.35 180 top
TP5  7.95,5.8 0 top
TP6  7.95,2.25 0 top
TP7  3.2,5.8 0 top
TP8  3.15,2.25 0 top
U1  23.9,25.05 90 top
U2  21.45,12.45 270 top
U3  12.3,6.35 0 top
U4  14.01,24.26 90 top
U5  5.45,25.35 180 top
U6  5.65,14 180 top
U7  5.65,17.15 180 top
U8  22.65,32.35 90 top
U9  25.6,3.15 180 top
U25  18.18,6.32 0 top
U$1  13.51,16.29 90 top
U$2  27.2,16.05 0 top
X1  11.63,10.83 180 top
Y1  6.99,21.44 270 top

### Tracks (layer width: path | path; a pad name or v marks a point on that pad's centre or on a via)
ANT
  Top 0.305: U4.10 14.27,25.72 C11.2 14.27,27.65 C12.2
CE
  Top 0.127: U9.4 28.1,3.52 28.35,3.27 R8.1
D+  (via drill 0.2)
  Top 0.127: v21.6,33.55 21.6,32.82 U8.10 U8.1 U1.45
  Top 0.152: v3.93,7.42 3.93,6.53 TP7.TP
  Bottom 0.127: v3.93,7.42 5.78,7.42 7.3,8.95 13.38,8.95 13.71,9.28 14.57,9.28 15.35,10.07 15.35,10.53 16.05,11.22 17.34,11.22 18.15,12.03 18.15,12.6 19.51,13.96 19.51,17.52 20.45,18.47 20.45,20.09 20.17,20.37 20.17,20.38 21.1,21.3 21.1,28.15 21.62,28.67 21.62,29.77 21.6,29.78 v21.6,33.55
D-  (via drill 0.2)
  Top 0.127: v22.36,33.57 22.15,33.36 U8.9 U8.2 U1.44
  Top 0.152: v3.77,3.92 3.77,2.87 TP8.TP
  Bottom 0.127: v3.77,3.92 8.49,8.64 13.46,8.64 13.83,9 14.78,9 15.63,9.85 15.63,10.41 16.16,10.95 17.46,10.95 18.43,11.91 18.43,12.49 19.79,13.85 19.79,17.41 20.8,18.42 20.8,20.61 21.38,21.19 21.38,27.98 22.36,28.96 v22.36,33.57
FRST  (via drill 0.2)
  Top 0.127: U7.1 U7.10 4.83,16.15 4.48,15.8 J1.6 3.05,15.8 2.85,16 2.85,18.35 3.82,19.32 5.84,19.32 6.11,19.05 v7.3,19.05 | U$1.27 14.89,19.31 v14.89,20.11
  Bottom 0.127: v14.89,20.11 16.77,18.23 16.77,15.66 16.49,15.38 16.49,14.72 15.19,13.43 13.87,13.43 13.47,13.82 12.38,13.82 | v7.3,19.05 8.45,17.9 8.45,16.6 10.18,14.87 10.39,14.87 11.43,13.82 12.38,13.82 | 12.38,13.82 | 12.38,13.82
GND  (via drill 0.2)
  Top 0.203: U$1.PAD U$1.PAD@VIA10 | U3.11 12.3,7.5 12.95,8.15 v13.85,8.15
  other vias: 6.1,28.65 9.85,32.9 12.1,20.65 23.1,24.45 8.15,9.9 17.85,29.9 18.35,31.65 24.15,26.35 11.75,28.5 16.65,25.3 3,30.7 7.55,27.95 12.75,21.05 13.05,21.75 16.3,28.85 8.55,24.25 15.05,27.7 16.75,26.45 24.25,29.2 10.55,22.25 17.2,30.85 13.35,27.65 29.5,19.35 13.3,28.7 29,30.85 12.4,25.8 15.95,26 15.1,28.8 25.55,27.55 12.3,22.4 6.4,31.05 20.05,29.5 9.35,23.4 18.55,32.7 22.65,27.9 11.65,30.3 13.85,21.85 17.3,32.2 13.05,26.75 11.75,26.55 20.55,28.25 9.5,27.55 11.8,21.45 16.05,27.1 24.45,22.7 17,24.7 25,21.3 8.25,32.25 13.05,29.9 23.5,21.85 22.7,25.75 4.65,32.4 2,17.85 10.05,20 8.2,29.2 25.4,14.55 9.15,30.75 3.9,22.8 2.1,24.9 2.65,28.05 2.55,19.95 22.2,14.15 24.9,24.85 3.55,21.35 10.05,8.1 29.95,11.65 4,12.4 9.5,16.8 29.7,13.3 26.45,7.4 24.3,6.35 28.1,8.4 23.15,14.15 5.05,6.8 15.1,1.95 17,9.5 5.9,3.1 5.7,4.8 31,33.55 15.4,29.9 6.5,9.5 5.45,2 29.5,5.65 2.25,7.9 5.05,10 13.3,4.15 24.55,33.55 28.1,32.1 29.5,32.4 28.5,33.55 29.75,33.55 18.5,33.55 20.6,32.85 20.25,33.55 24.65,32.2 23.5,33.55 3.5,33.55 1,33.55 2.25,33.55 17.25,33.55 11,33.55 12.25,33.55 13.1,33.2 15.3,33.25 16.25,33.55 4.75,33.55 6,33.55 7.25,33.55 8.5,33.55 9.75,33.55 0.95,32.25 0.95,26 0.95,27.25 0.95,28.5 0.95,30.05 0.95,31 0.95,19.75 0.95,21 0.95,22.15 0.95,23.55 0.95,24.75 1,18.1 2.35,12.05 0.95,13.25 0.95,14.5 0.95,15.75 0.95,17 0.95,5.75 0.95,7 0.95,8.25 0.95,9.5 0.95,10.75 0.95,4.25 0.95,0.5 0.95,1.75 0.95,3 14.9,3.1 8.5,0.55 10.05,3.15 11.5,3.4 13.25,3.25 15.15,0.75 2.25,0.55 3.5,0.55 4.75,0.55 6,0.55 7.25,0.55 28.5,0.55 20.75,1.8 23.5,0.55 24.85,0.55 26,0.55 27.25,0.55 19.45,4.45 20.85,4.15 18.45,3.3 19.65,3.45 21,0.55 29.7,0.5 30.95,0.5 30.95,1.75 30.95,3 30.95,18.25 30.95,12 30.95,13.25 30.95,14.5 29.9,14.55 30.3,17.5 30.95,5.75 30.95,8.25 30.95,10.75 30.95,32.25 30.95,26 30.95,27.25 28.15,28.2 29.7,29.7 30.95,31 30.95,19.75 28.5,20.5 28.4,22.7 28.35,24.4 30.95,24.75 4.25,11.2 2.65,9.71 22.66,22.03 4.05,18.6
  pour GND: 0.5,34 31.45,34 31.45,0.05 0.45,0.05 0.45,33.95
  pour Top: 18.5,6.15 19.4,6.15 20.55,5 23.6,5 23.75,5.15 23.75,6.85 25.8,8.9 25.8,11.1 31.45,11.1 31.45,0 0.25,0 0.25,10.9 6.5,10.9 6.5,3.8 6.6,3.7 9.95,3.7 10.85,4.6 16.6,4.6 16.95,4.95 17.9,4.95 18.5,5.55
  pour Top: 17.9,7 17.9,9.45 19.2,10.75 26.05,10.75 26.05,15.7 10.95,15.7 4.8,9.55 6.5,7.85 14.95,7.85 15.25,7.55 16.55,7.55 17.1,7
  pour Top: 0.15,11.05 0.15,34 31.55,34 31.55,11.05
  pour Bottom: -0.15,34.35 31.55,34.35 31.7,34.2 31.7,-0.2 -0.05,-0.2 -0.25,0 -0.25,34.25
INT_VL
  Top 0.127: R9.1 29.05,1.27 U9.1
LED_1  (via drill 0.2)
  Top 0.127: R7.1 28.2,5.2 v28.25,5.25 | v19.3,11.2 17.48,11.2 17.22,10.95 15.65,10.95 15.1,11.5 14.48,11.5 14.15,11.83 13.83,11.83 13.39,12.27 13.39,13.21 U$1.6
  Bottom 0.127: v28.25,5.25 27,4 26.33,4 25.98,3.65 25.32,3.65 24.97,4 24.95,4 24.95,4.02 24.85,4.12 24.85,4.78 24.95,4.88 24.95,7.8 25.85,8.7 25.85,10.05 25.55,10.35 23.82,10.35 23.58,10.11 22.92,10.11 22.7,10.33 22.23,10.33 21.93,10.63 21.93,10.82 21.55,11.2 v19.3,11.2
LED_2  (via drill 0.2)
  Top 0.127: R4.1 27.36,6.99 v27.3,7.05 | v28.15,25.7 28.25,25.8 U1.26
  Bottom 0.127: v28.15,25.7 28.15,25.5 27.47,24.82 27.47,18.43 28.68,17.23 28.95,17.23 29.58,16.6 29.58,15.7 28.95,15.07 28.58,15.07 27.37,13.86 27.37,11.56 27.1,11.29 27.1,7.25 v27.3,7.05
LED_3  (via drill 0.2)
  Top 0.127: R5.1 28.15,9.56 v28.15,10.4 | v28.27,26.46 28.43,26.3 U1.27
  Bottom 0.127: v28.15,10.4 28.15,14.25 28.69,14.79 29.06,14.79 29.86,15.59 29.86,16.71 29.06,17.51 28.79,17.51 27.75,18.55 27.75,24.57 28.7,25.52 28.7,26.03 v28.27,26.46
N$1
  Top 0.127: U$1.2 11.71,12.16 X1.2 11.21,10.01 C1.1
N$2
  Top 0.127: U$1.3 12.11,12.3 12.88,11.53 X1.1 12.15,10.11 C2.1
N$3
  Top 0.127: Y1.3 8.13,20.54 C3.1 10.78,20.54 11.68,19.64 11.68,19.32 U$1.35
N$4
  Top 0.127: U$1.34 12.08,19.32 12.08,19.64 10.19,21.52 C4.1 7.21,21.52 Y1.1
N$5
  Top 0.254: C5.2 10.37,12.35 U$1.1
N$6
  Top 0.254: U$1.30 13.71,20.05 C8.2
  Top 0.305: C8.2 13.75,20.2 13.75,20.84 L1.1
N$7
  Top 0.127: R4.2 30,6.99 D1.1
N$8
  Top 0.127: R5.2 29.11,9.52 D2.1
N$9
  Top 0.127: 10.3,14.49 U$1.47
  Top 0.254: L2.2 9.24,14.49 9.78,14.49 9.79,14.48 10.22,14.48 10.22,14.49 10.3,14.49
N$10
  Top 0.254: L3.2 7.71,15.69 7.78,15.62 7.78,14.73 L2.1
N$11
  Top 0.203: U$1.46 9.96,14.89 9.9,14.95
  Top 0.254: L3.1 8.67,15.81 C10.1 8.71,15.79 9.3,15.2 9.74,15.2 9.9,15.04 9.9,14.95
N$13
  Top 0.254: Q3.2 27.2,13.88 U$2.1
N$14
  Top 0.127: U1.4 21.65,17.65 Q1.1 20.93,17.02 21.05,17.02 21.67,16.41 21.67,15.06 C16.2
N$15
  Top 0.305: C12.1 14.24,28.64 J3.FEED
N$16
  Top 0.127: Q1.3 19.5,16.05 19.5,16 19.3,16.2 19,16.2 18.93,16.27 18.93,17.46 19.27,17.8 20.7,17.8 21.15,18.25 U1.3
  Top 0.15: C17.2 19.55,15.93 Q1.3
N$17
  Top 0.127: U2.1 19.2,13.45 Q2.2
N$18
  Top 0.127: Q2.1 19.1,12.95 U2.2
N$19
  Top 0.127: R7.2 29.98,4.39 D7.1
N$20
  Top 0.15: U3.10 13.72,7.38 R2.2
N$22
  pour Top: 9.75,4.05 6.85,4.05 6.85,7.45 11.15,7.45 11.15,5.45
N$24  (via drill 0.2)
  Top 0.127: Q3.1 28.55,13.32 28.55,16.1 v28.5,16.15 | v26.15,29.55 U1.36
  Bottom 0.127: v28.5,16.15 26.25,18.4 26.25,29.45 v26.15,29.55
N$62
  Top 0.127: C81.2 24.95,16.88 Q5.1 22.65,18.3 U1.6
N$63
  Top 0.127: U1.5 22.12,19.27 22.12,17.68 22,17.55 22,16.15 22.32,15.82 Q5.3 22.72,15.1 C82.2
N$80
  pour Top: 18.5,6.45 18.5,6.65 23.4,6.65 23.4,5.35 20.6,5.35 19.5,6.45
N$81
  Top 0.15: R29.2 18.86,5.29 U25.5
N$84
  Top 0.203: D4.1 16.04,3.25 R30.2
NRESET  (via drill 0.2)
  Top 0.127: J1.4 4.3,14.8 4.6,14.5 U6.7 U6.4 6.25,14.68 6.44,14.68 6.57,14.81 6.57,14.87 7.07,15.38 v7.2,15.38 | v17.59,18.05 17.59,18.77 R1.1 17.31,18.49 U$1.24
  Bottom 0.127: v7.2,15.38 7.48,15.38 9.39,13.47 9.81,13.47 10.85,12.42 12.85,12.42 13.72,11.55 14.38,11.55 14.61,11.78 15.02,11.78 15.33,12.09 15.33,12.38 17.48,14.53 17.51,14.53 17.81,14.84 17.81,16.11 17.6,16.32 17.54,16.32 17.19,16.68 17.19,17.11 17.59,17.51 v17.59,18.05
RF
  Top 0.305: L1.2 C9.2 14.79,22.79 U4.4
RX  (via drill 0.2)
  Top 0.127: J1.7 4.34,16.3 4.66,16.62 5.2,16.62 U7.9 U7.2 6.7,16.65 v7,16.35 | U$1.10 14.91,12.4 | 14.91,12.4 v14.81,12.3 | U1.51 19.8,27.8 v19.85,27.75 | v17.05,21.2 17.32,20.93 19.59,20.93 20.01,21.36 20.01,21.81 20.55,22.34 v20.55,22.39 | 14.91,12.4 15.75,12.4 16.17,11.98 16.49,11.98 16.73,11.74 v16.89,11.74
  Bottom 0.127: v14.81,12.3 14.64,12.13 14.56,12.13 14.26,11.83 13.83,11.83 12.96,12.7 10.97,12.7 9.92,13.75 9.51,13.75 9.36,13.89 9.36,13.99 v7,16.35 | v20.55,22.39 20.38,22.39 20.37,22.4 20.37,27.23 v19.85,27.75 | v17.05,21.2 17.87,20.38 17.87,19.73 18.98,18.62 18.98,18.29 19.23,18.04 19.23,14.08 17.87,12.72 17.87,12.14 17.56,11.84 16.99,11.84 v16.89,11.74
SCL  (via drill 0.2)
  Top 0.127: R3.1 27.15,32.92 U1.34 27.18,30.77 27.18,30.21 27.29,30.11 v27.29,29.6 | U2.7 22.8,11.84 23.11,11.84 23.25,11.71 v23.25,10.91 | v25.65,4.45 26.62,4.45 U9.5
  Bottom 0.127: v25.65,4.45 25.65,7.7 26.41,8.46 26.41,10.34 25.84,10.91 v23.25,10.91 27.7,15.35 28.83,15.35 29.3,15.82 29.3,16.48 28.83,16.95 28.56,16.95 27.19,18.32 27.19,25.09 27.29,25.18 v27.29,29.6
SDA  (via drill 0.2)
  Top 0.127: R6.1 26.62,30.82 U1.35 26.72,30.73 26.72,29.1 v26.77,29.05 | v22.45,10.85 22.45,11.21 U2.6 | U9.6 26.17,5.66 v26.17,5.85
  Bottom 0.127: 22.51,10.91 27.23,15.63 28.71,15.63 29.02,15.94 29.02,16.36 28.71,16.67 28.45,16.67 26.77,18.34 v26.77,29.05 | 22.51,10.91 22.46,10.86 22.63,10.69 22.73,10.69 23.04,10.39 23.46,10.39 23.7,10.63 25.67,10.63 26.13,10.17 26.13,8.58 25.23,7.68 25.23,4.76 25.13,4.67 25.13,4.24 25.43,3.93 25.86,3.93 26.17,4.24 v26.17,5.85 | v22.45,10.85 22.45,10.9 22.49,10.94 22.51,10.91
STBOOT  (via drill 0.2)
  Top 0.127: J2.6 U5.6 | U5.6 | U5.6 U5.5 | R19.1 16.82,23.3 U1.60 21.75,23.3 v21.9,23.15 | v15.8,9.2 15.7,9.3 14.35,9.3 13.95,9.7 v13.95,9.8
  Top 0.15: U5.5 | U5.5 v6.75,26.35
  Bottom 0.127: v6.75,26.35 6.75,26.09 4.7,24.04 4.7,13.26 6.85,11.1 10.18,11.1 10.46,10.81 12.48,10.81 13.14,10.15 13.59,10.15 v13.95,9.8 | v15.8,9.2 16.23,9.63 16.36,9.63 17.12,10.39 17.69,10.39 18.99,11.68 18.99,12.26 20.35,13.62 20.35,17.18 21.49,18.32 21.49,19.75 21.97,20.23 21.97,23.08 v21.9,23.15
STCLK  (via drill 0.2)
  Top 0.127: J2.3 U5.9 U5.2 v6.65,24.85 | v21.1,29.55 21.15,29.6 U1.46 | v19.5,18.5 19.5,18.43 18.65,17.58 18.65,16.41 v17.29,15.05
  Bottom 0.127: v19.5,18.5 19.77,18.77 19.77,20 19.31,20.47 19.31,20.51 18.7,21.12 18.7,22.77 19.33,23.4 19.33,27.96 19.63,28.27 19.82,28.27 v21.1,29.55 | v6.65,24.85 5.38,23.58 5.38,19.82 7.89,17.31 7.89,16.37 9.95,14.31 10.16,14.31 11.2,13.26 13.24,13.26 13.64,12.87 14.26,12.87 14.28,12.85 15.41,12.85 17.29,14.73 v17.29,15.05
STIO  (via drill 0.2)
  Top 0.127: J2.2 U5.10 U5.1 6.39,24.35 v6.65,24.09 | v17.29,15.85 17.64,15.85 18.38,16.59 18.38,17.7 18.68,18 18.68,18.61 19.24,19.18 v19.24,19.25 19.27,19.23 | v19.25,28.8 U1.49
  Bottom 0.127: v17.29,15.85 17.29,15.78 16.77,15.27 16.77,14.61 15.31,13.15 13.75,13.15 13.36,13.54 11.32,13.54 10.27,14.59 10.07,14.59 8.17,16.48 8.17,17.43 5.66,19.94 5.66,23.1 v6.65,24.09 | v19.24,19.25 19.3,19.31 19.3,19.98 18.93,20.35 18.93,20.5 18.42,21 18.42,22.89 18.93,23.4 18.93,28.48 v19.25,28.8
STRST  (via drill 0.2)
  Top 0.127: R16.2 24.27,18.1 23.45,18.1 23.15,18.4 U1.7 23.15,20.1 22.75,20.5 v21.45,20.5 | J2.4 3.75,25.4 4.14,25.4 4.56,25.82 5,25.82 U5.7 U5.4 6.52,25.85 6.54,25.83 7.32,25.83 v7.38,25.89 | v14.66,10.16 v16.14,10.16 v16.15,10.15
  Bottom 0.127: v7.38,25.89 7.23,25.89 6.71,25.37 6.44,25.37 5,23.93 5,13.4 6.97,11.43 10.26,11.43 10.39,11.31 12.38,11.31 13.26,10.43 14.39,10.43 v14.66,10.16 | v21.45,20.5 21.21,20.26 21.21,18.43 20.07,17.29 20.07,13.73 18.71,12.37 18.71,11.8 17.57,10.66 16.68,10.66 16.16,10.15 v16.15,10.15
SWDCLK  (via drill 0.2)
  Top 0.127: J1.3 4.05,14.3 4.86,13.5 U6.9 U6.2 6.37,13.5 v6.81,13.06 | v16.45,19.9 15.84,19.29 U$1.25
  Bottom 0.127: v16.45,19.9 16.75,19.9 17.03,19.62 17.03,19.37 18.06,18.35 18.07,18.35 18.12,18.3 18.12,17.9 18.37,17.66 18.37,14.6 17.74,13.97 17.71,13.97 15.89,12.14 15.89,11.85 15.25,11.22 14.84,11.22 14.61,10.99 13.49,10.99 12.62,11.86 10.62,11.86 10.48,12.01 7.91,12.01 6.96,12.96 6.91,12.96 v6.81,13.06
SWDIO  (via drill 0.2)
  Top 0.127: J1.2 3.77,13.8 3.78,13.82 4.04,13.82 4.86,13 U6.10 U6.1 6.1,13 6.9,12.2 v6.95,12.2 | U$1.26 15.31,19.69 v15.69,20.07
  Bottom 0.127: v15.69,20.07 15.69,20.18 15.93,20.42 16.66,20.42 17.31,19.77 17.31,19.49 18.18,18.63 18.19,18.63 18.4,18.41 18.4,18.02 18.65,17.77 18.65,14.49 17.85,13.69 17.83,13.69 16.17,12.03 16.17,11.74 15.37,10.94 14.96,10.94 14.73,10.71 13.37,10.71 12.5,11.59 10.51,11.59 10.36,11.73 7.42,11.73 v6.95,12.2
SWO  (via drill 0.2)
  Top 0.127: J1.5 4.25,15.3 4.55,15 U6.6 U6.5 6.07,15.26 v6.4,15.59 | U$1.21 16.53,17.31 16.81,17.31 17.27,16.84 v17.76,16.84
  Bottom 0.127: v6.4,15.59 6.68,15.31 6.68,15.16 6.99,14.86 7.33,14.86 9,13.19 9.69,13.19 10.74,12.14 12.73,12.14 13.6,11.27 14.5,11.27 14.73,11.5 15.14,11.5 15.61,11.97 15.61,12.26 17.6,14.25 17.62,14.25 18.09,14.72 18.09,16.51 v17.76,16.84
TX  (via drill 0.2)
  Top 0.127: J1.8 4.09,16.8 4.96,17.67 5.22,17.67 U7.7 U7.4 6.8,17.65 v6.85,17.6 | U$1.8 14.05,13.23 v14.05,12.35 14.29,12.11 14.29,12.09 14.59,11.78 15.21,11.78 15.29,11.7 16.2,11.7 16.68,11.22 17.11,11.22 17.41,11.53 17.41,11.66 17.55,11.8 17.55,12.16 v17.35,12.36 | U1.52 19.54,27.3 v19.85,26.99 | v20.57,21.53 20.57,21.48 19.75,20.66 19.75,20.65 17.74,20.65 17.31,20.23 16.88,20.23 16.17,20.94 v15.95,20.94
  Bottom 0.127: v14.05,12.35 13.83,12.57 13.5,12.57 13.09,12.98 11.08,12.98 10.04,14.03 9.84,14.03 7.61,16.25 7.61,16.84 v6.85,17.6 | v19.85,26.99 19.85,22.07 20.38,21.53 v20.57,21.53 | v15.95,20.94 16.41,20.94 16.65,20.7 16.78,20.7 17.59,19.89 17.59,19.62 18.29,18.92 | 18.29,18.91 18.29,18.92 | 18.29,18.92 18.7,18.51 18.7,18.17 18.95,17.92 18.95,14.2 17.52,12.76 17.52,12.53 v17.35,12.36
TXEN  (via drill 0.2)
  Top 0.127: U$1.23 16.87,18.09 17.07,17.89 17.07,17.73 17.33,17.48 17.81,17.48 18.1,17.77 18.1,17.81 18.4,18.12 18.4,18.83 18.64,19.07 v18.64,19.72 | v15.85,22.7 15.85,23.11 U4.5
  Bottom 0.127: v15.85,22.7 15.85,22.06 16.2,21.72 17.27,21.72 18.64,20.34 v18.64,19.72
VBUS
  pour Top: 13.7,4.9 16.45,4.9 16.8,5.25 17.7,5.25 17.9,5.45 17.9,6.65 17.05,6.65 16.85,6.85 15.35,6.85 14.75,7.45 13.5,7.45 13.5,5.1
VDD  (via drill 0.2, 0.25, 0.3, 0.35)
  Top 0.127: J1.9 4.05,17.3 4.91,18.15 U7.6 | 23.15,4.28 C22.1 | U9.10 23.5,2.77 C21.1 22.43,2.38 C18.1 | TP1.TP 19.1,1.4 v19.45,1.75 | C6.2 v8.37,13.08
  Top 0.15: v20.89,14.15 19.67,14.15 19.34,14.48 17.97,14.48 C14.2
  Top 0.203: U7.6 U7.5
  Top 0.254: U$1.13 17.43,14.09 C14.2 | C6.2 9.62,13.2 U$1.48 | U$1.36 9.71,19.29 C19.1 9.12,17.82 v9.15,17.8 | U9.8 23.15,4.28 | C22.1 22.27,4.28 v22.25,4.25 | C18.1 v20.9,2.85 | v30.05,2.25 30.02,2.27 R9.2 28.4,2.27 R8.2 | U9.10 25.47,2.77 v25.5,2.75 | U2.10 23.9,13.45 C20.1 24.15,13.89 v24.5,14.24 | R16.1 25.55,17.8 | 25.55,17.8 25.85,17.8 v26.25,17.4 26.1,17.25 C23.1 | U1.13 26.15,18.4 25.55,17.8 | R6.2 25.77,32.4 25.99,32.61 | 25.99,32.61 R3.2 | 25.99,32.61 25.59,32.61 v25.25,32.95 | U1.48 20.15,31.48 C24.1 19.62,32.85 v19.65,32.85 | U1.32 30.38,28.8 C26.1 30.75,29.27 v30.75,30.05 | U1.19 30.68,22.3 C25.1 30.8,22.52 v30.8,23.35 | U4.6 15.48,24.03 v16.4,24.03 | U4.14 11.41,24.51 C15.2 11.32,24.45 v10.55,24.45 | U4.16 11.63,23.51 C13.1 10.72,23.27 v10.6,23.4 | J2.9 v4.9,27.85 | U7.5 5.6,18.62 v5.6,18.75 | Q3.3 27,11.65 v26.8,11.85 | R1.2 18.28,20.31 20.06,20.31 | 20.06,20.31 20.41,20.31 21.3,21.19 v22.9,21.19 | 20.15,20.22 20.06,20.31 | U1.64 18.22,21.37 18.86,21.37 18.97,21.48 v19.36,21.48
  Top 0.305: 20.15,20.22 U1.1
  Top 1.27: TP2.TP TP1.TP
  other vias: 20.95,7.5 21.95,7.55 20.65,10 21.55,10 22.95,7.6 20,7.75 24.25,9.75 24.75,9.05 24.1,8.55 17.1,1.75 16.3,1.75 17.15,0.9 16.3,0.9 18.65,0.9 19.45,0.9 18.65,1.75
  pour Top: 18.5,7 18.5,9.05 18.7,9.25 18.8,9.35 23.35,9.35 23.35,8 22.35,7
  pour Top: 18.65,9.25 19.85,10.45 25.05,10.45 25.1,10.4 25.1,8.75 24.25,7.9 19.7,7.9 18.65,8.95
  pour VDD: 0.65,34 31.6,34 31.6,0.05 0.6,0.05 0.6,33.95

### Text on the board
tPlace: OVERWATCH | NODE | USB